# Altium schematic sheet MotorCellOne.SchDoc: ODRIVE-FOC
size A3; DocumentNumber: SEASKY; Revision: V1.1
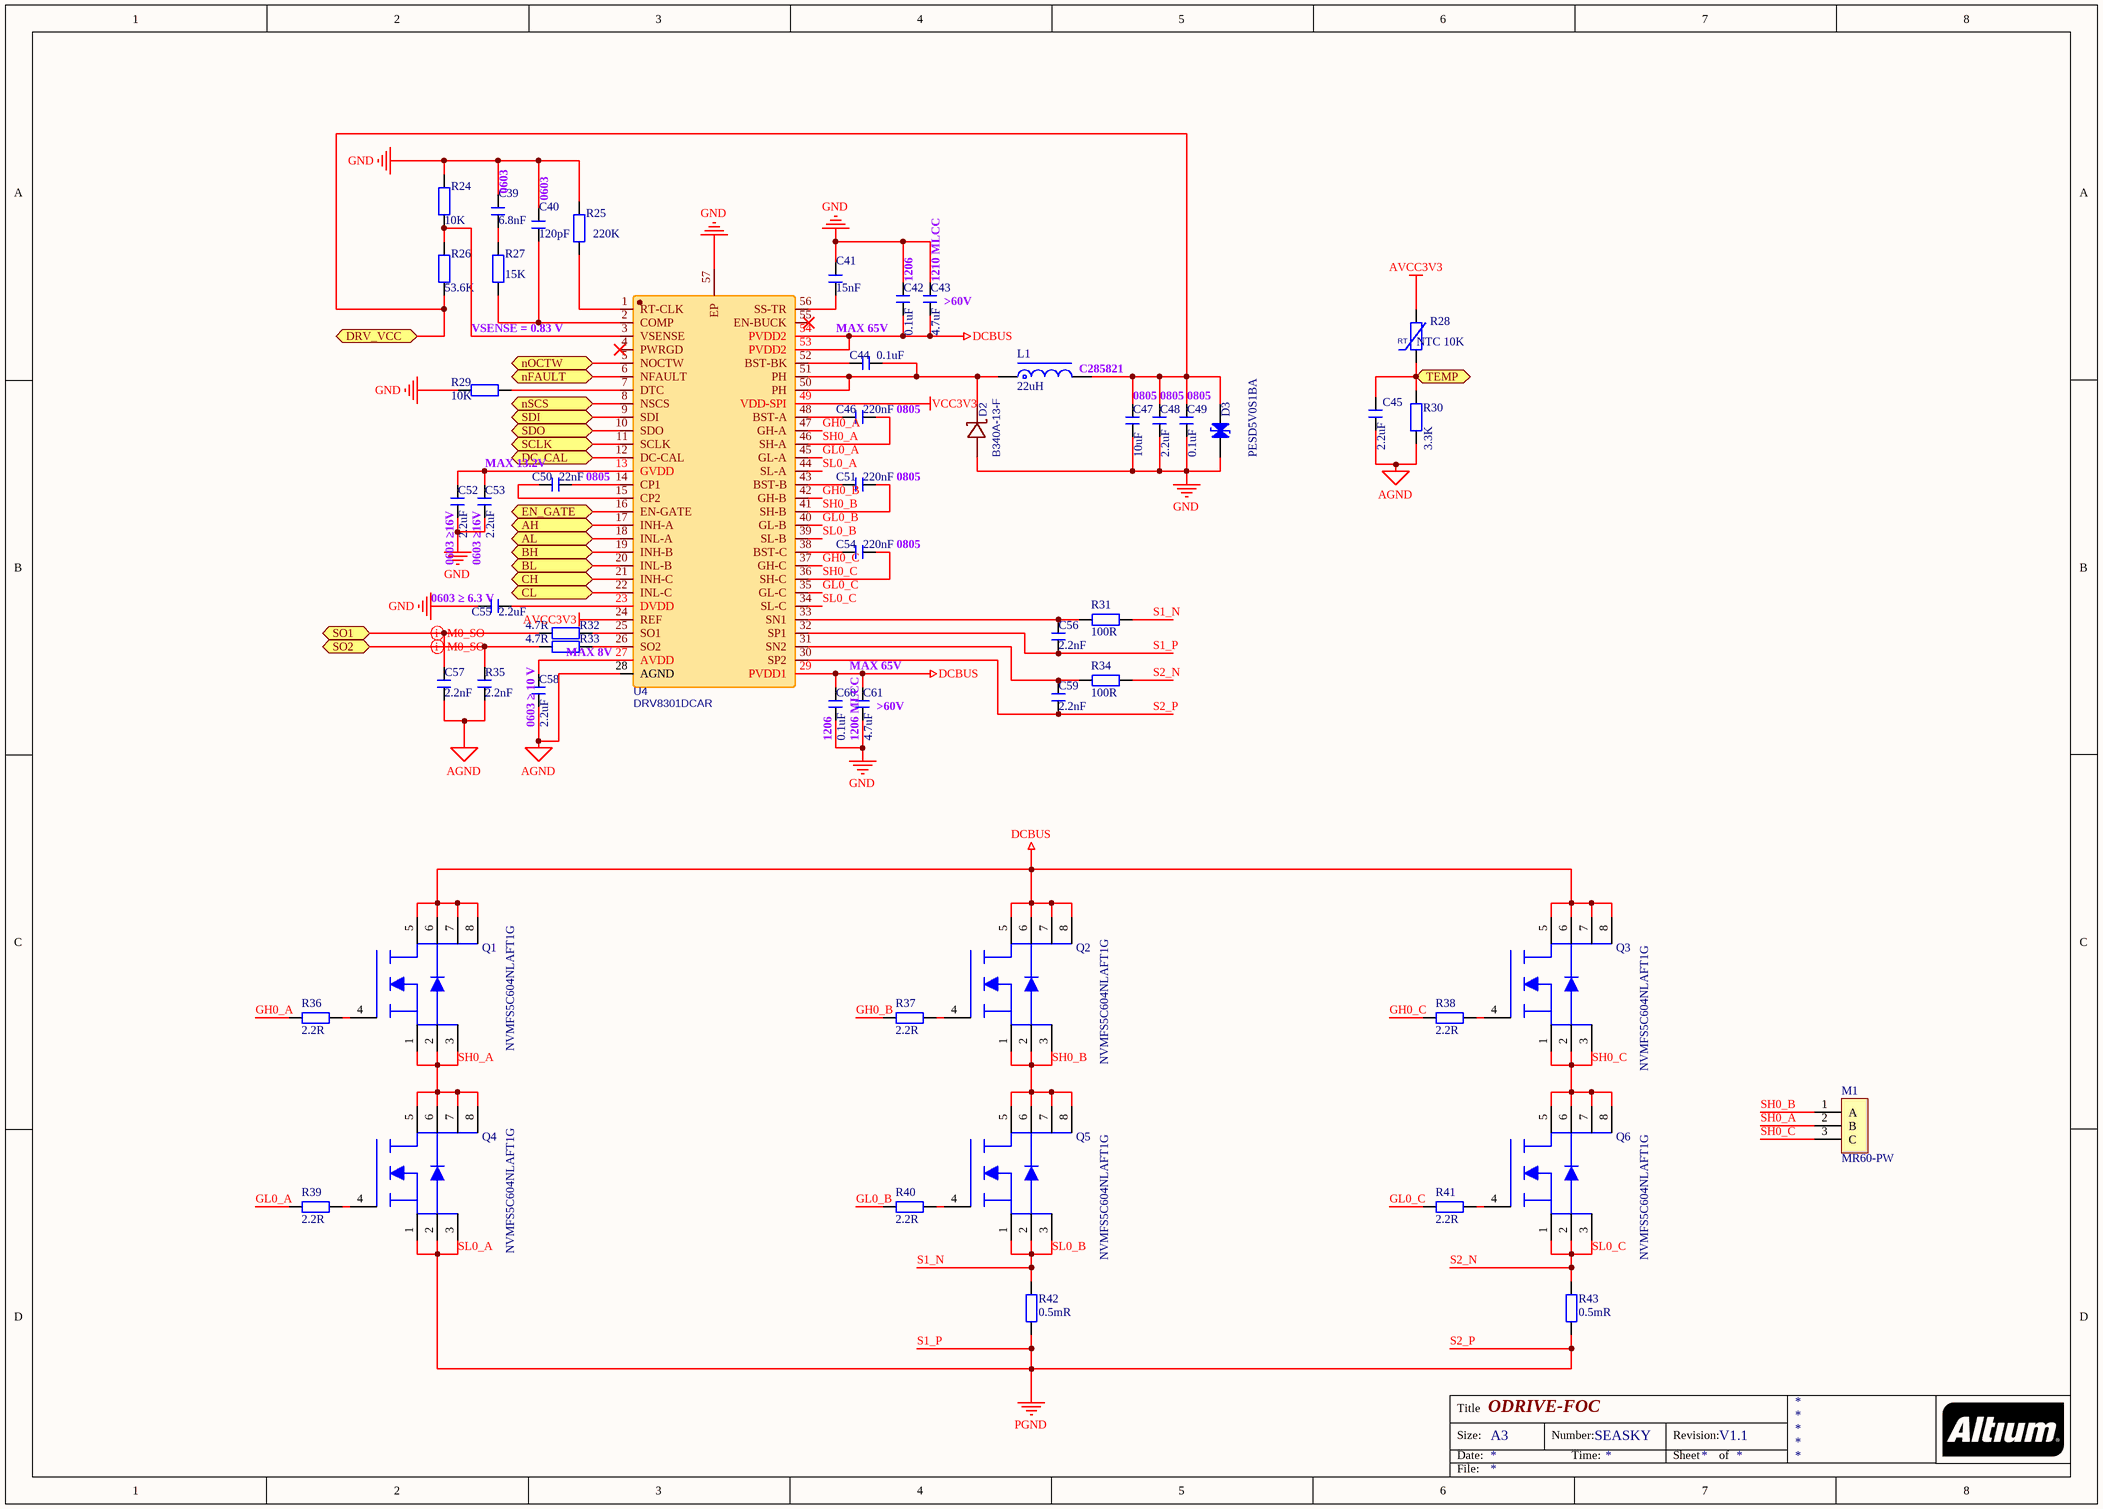
[diagram p0: MotorCellOne.SchDoc]

## Parts
C39  6.8nF  [C 0603_L]
C40  120pF  [C 0603_L]
C41  15nF  [C 0603_L]
C42  0.1uF  [C 1206_L]
C43  4.7uF  [C 1210_L]
C44  0.1uF  [C 0603_L]
C45  2.2uF  [C 0603_L]
C46  220nF  [C 0805_L]
C47  10uF  [C 0805_L]
C48  2.2uF  [C 0805_L]
C49  0.1uF  [C 0805_L]
C50  22nF  [C 0805_L]
C51  220nF  [C 0805_L]
C52  2.2uF  [C 0603_L]
C53  2.2uF  [C 0603_L]
C54  220nF  [C 0805_L]
C55  2.2uF  [C 0603_L]
C56  2.2nF  [C 0603_L]
C57  2.2nF  [C 0603_L]
C58  2.2uF  [C 0603_L]
C59  2.2nF  [C 0603_L]
C60  0.1uF  [C 1206_L]
C61  4.7uF  [C 1210_L]
D2  B340A-13-F  [SMA_L4.4-W2.6-LS5.0-RD]
D3  PESD5V0S1BA  [SOD-323]
L1  22uH  [CD53]
M1  MR60-PW  [MR60-PW]
Q1  NVMFS5C604NLAFT1G  [PG-TDSON-8_L5.0-W6.0-P1.27-LS6.2-BL-EP]
Q2  NVMFS5C604NLAFT1G  [PG-TDSON-8_L5.0-W6.0-P1.27-LS6.2-BL-EP]
Q3  NVMFS5C604NLAFT1G  [PG-TDSON-8_L5.0-W6.0-P1.27-LS6.2-BL-EP]
Q4  NVMFS5C604NLAFT1G  [PG-TDSON-8_L5.0-W6.0-P1.27-LS6.2-BL-EP]
Q5  NVMFS5C604NLAFT1G  [PG-TDSON-8_L5.0-W6.0-P1.27-LS6.2-BL-EP]
Q6  NVMFS5C604NLAFT1G  [PG-TDSON-8_L5.0-W6.0-P1.27-LS6.2-BL-EP]
R24  10K  [R 0603_L]
R25  220K  [R 0603_L]
R26  53.6K  [R 0603_L]
R27  15K  [R 0603_L]
R28  NTC 10K  [R 0805-HP_L]
R29  10K  [R 0603_L]
R30  3.3K  [R 0805_L]
R31  100R  [R 0603_L]
R32  4.7R  [R 0603_L]
R33  4.7R  [R 0603_L]
R34  100R  [R 0603_L]
R35  2.2nF  [C 0603_L]
R36  2.2R  [R 0603_L]
R37  2.2R  [R 0603_L]
R38  2.2R  [R 0603_L]
R39  2.2R  [R 0603_L]
R40  2.2R  [R 0603_L]
R41  2.2R  [R 0603_L]
R42  0.5mR  [R3920]
R43  0.5mR  [R3920]
U4  DRV8301DCAR  [HTSSOP-56_L14.0-W6.0-P0.50-LS8.0-BL]

## Ports
AH (bidir), AL (bidir), BH (bidir), BL (bidir), CH (bidir), CL (bidir), DC_CAL (bidir), DRV_VCC (bidir), EN_GATE (bidir), nFAULT (bidir), nOCTW (bidir), nSCS (bidir), SCLK (bidir), SDI (bidir), SDO (bidir), SO1 (bidir), SO2 (bidir), TEMP (bidir)

## Nets
AGND: C45.2 C57.1 C58.1 R30.1 R35.1 U4.28(AGND)
AVCC3V3: R28.2 U4.24(REF)
DCBUS: C42.1 C43.1 C60.2 C61.2 Q1.5 Q1.6 Q1.7 Q1.8 Q2.5 Q2.6 Q2.7 Q2.8 Q3.5 Q3.6 Q3.7 Q3.8 U4.29(PVDD1) U4.53(PVDD2) U4.54(PVDD2)
GND: C39.1 C40.1 C41.1 C42.2 C43.2 C47.1 C48.1 C49.1 C52.1 C53.1 C55.1 C60.1 C61.1 D2.2(A) D3.2(K) R24.2 R25.2 R29.2 U4.57(EP)
S1_P: C56.1 C59.1 Q4.1 Q4.2 Q4.3 R42.1 R43.1 U4.30(SP2) U4.32(SP1) U4.44(SL-A)  [also labelled PGND, S2_P, SL0_A]
VCC3V3: U4.49(VDD-SPI)
AH: U4.17(INH-A) ; port AH
AL: U4.18(INL-A) ; port AL
BH: U4.19(INH-B) ; port BH
BL: U4.20(INL-B) ; port BL
CH: U4.21(INH-C) ; port CH
CL: U4.22(INL-C) ; port CL
DC_CAL: U4.12(DC-CAL) ; port DC_CAL
DRV_VCC: C47.2 C48.2 C49.2 D3.1(A) L1.2 R26.1 ; port DRV_VCC
EN_GATE: U4.16(EN-GATE) ; port EN_GATE
GH0_A: R36.1 U4.47(GH-A)
GH0_B: R37.1 U4.42(GH-B)
GH0_C: R38.1 U4.37(GH-C)
GL0_A: R39.1 U4.45(GL-A)
GL0_B: R40.1 U4.40(GL-B)
GL0_C: R41.1 U4.35(GL-C)
nFAULT: U4.6(NFAULT) ; port nFAULT
nOCTW: U4.5(NOCTW) ; port nOCTW
nSCS: U4.8(NSCS) ; port nSCS
S1_N: Q5.1 Q5.2 Q5.3 R31.2 R42.2 U4.39(SL-B)  [also labelled SL0_B]
S2_N: Q6.1 Q6.2 Q6.3 R34.2 R43.2 U4.34(SL-C)  [also labelled SL0_C]
SCLK: U4.11(SCLK) ; port SCLK
SDI: U4.9(SDI) ; port SDI
SDO: U4.10(SDO) ; port SDO
SH0_A: C46.2 M1.2(B) Q1.1 Q1.2 Q1.3 Q4.5 Q4.6 Q4.7 Q4.8 U4.46(SH-A)
SH0_B: C51.2 M1.1(A) Q2.1 Q2.2 Q2.3 Q5.5 Q5.6 Q5.7 Q5.8 U4.41(SH-B)
SH0_C: C54.2 M1.3(C) Q3.1 Q3.2 Q3.3 Q6.5 Q6.6 Q6.7 Q6.8 U4.36(SH-C)
SO1: C57.2 R32.1 ; port SO1
SO2: R33.1 R35.2 ; port SO2
TEMP: C45.1 R28.1 R30.2 ; port TEMP
NetC39_2: C39.2 R27.2
NetC40_2: C40.2 R27.1 U4.2(COMP)
NetC41_2: C41.2 U4.56(SS-TR)
NetC44_1: C44.1 D2.1(K) L1.1 U4.50(PH) U4.51(PH)
NetC44_2: C44.2 U4.52(BST-BK)
NetC46_1: C46.1 U4.48(BST-A)
NetC50_1: C50.1 U4.14(CP1)
NetC50_2: C50.2 U4.15(CP2)
NetC51_1: C51.1 U4.43(BST-B)
NetC52_2: C52.2 C53.2 U4.13(GVDD)
NetC54_1: C54.1 U4.38(BST-C)
NetC55_2: C55.2 U4.23(DVDD)
NetC56_2: C56.2 R31.1 U4.33(SN1)
NetC58_2: C58.2 U4.27(AVDD)
NetC59_2: C59.2 R34.1 U4.31(SN2)
NetQ1_4: Q1.4 R36.2
NetQ2_4: Q2.4 R37.2
NetQ3_4: Q3.4 R38.2
NetQ4_4: Q4.4 R39.2
NetQ5_4: Q5.4 R40.2
NetQ6_4: Q6.4 R41.2
NetR24_1: R24.1 R26.2 U4.3(VSENSE)
NetR25_1: R25.1 U4.1(RT-CLK)
NetR29_1: R29.1 U4.7(DTC)
NetR32_2: R32.2 U4.25(SO1)
NetR33_2: R33.2 U4.26(SO2)

Not connected (* = marked no-connect by the designer): U4 4(PWRGD)* 55(EN-BUCK)*

## Layout directives
differential pair: SO1, SO2

## Notes on the sheet
- (near C39) 0603
- 0603
- 1206
- (near C43) >60V
- (near C43) 1210 MLCC
- VSENSE = 0.83 V
- MAX 65V
- (near L1) C285821
- 0805
- MAX 13.2V
- (near C51) 0805
- (near C52) 0603 ≥16V
- (near C53) 0603 ≥16V
- (near C54) 0805
- (near C55) 0603 ≥ 6.3 V
- (near C58) 0603 ≥ 10 V
- (near R33) MAX 8V
- (near C61) >60V
- (near C60) 1206
- (near C61) 1206 MLCC
- Title
- Size:
- Date:
- A3
- Number:
- Time:
- Revision:
- Sheet
- of
- File:

## Library data of the parts
C39-C61 R35 = C: 贴片电容
D2 = B340A-13-F: BOM_Manufacturer: DIODES; SMT Type: Extend; BOM_Supplier: LCSC; BOM_Manufacturer Part: B340A-13-F; BOM_Supplier Part: C85098; BOM_JLCPCB SMD: Yes; spicePre: D; spiceSymbolName: B340A-13-F
D3 = PESD5V0S1BA: PESD5V0S1BA、ESD二极管、5V
L1 = L-SMD: CD系列贴片线绕功率电感
Q1-Q6 = BSC037N08NS5ATMA1
R24-R27 R29-R34 R36-R41 = R: 贴片电阻
R28 = RT: 热敏电阻
R42 R43 = R-Precision: 精密贴片电阻
U4 = DRV8301DCAR: BOM_Manufacturer: Texas Instruments; Contributor: LCSC; SMT Type: Extend; BOM_Supplier: LCSC; BOM_Supplier Part: C98969; BOM_Manufacturer Part: DRV8301DCAR; BOM_JLCPCB SMD: Yes; spicePre: U; spiceSymbolName: DRV8301DCAR